# EAGLE design battery_pack (EAGLE 6.6.0)
AUTHOR: Joshua Adkins; REV: A; TITLE: Battery_Pack
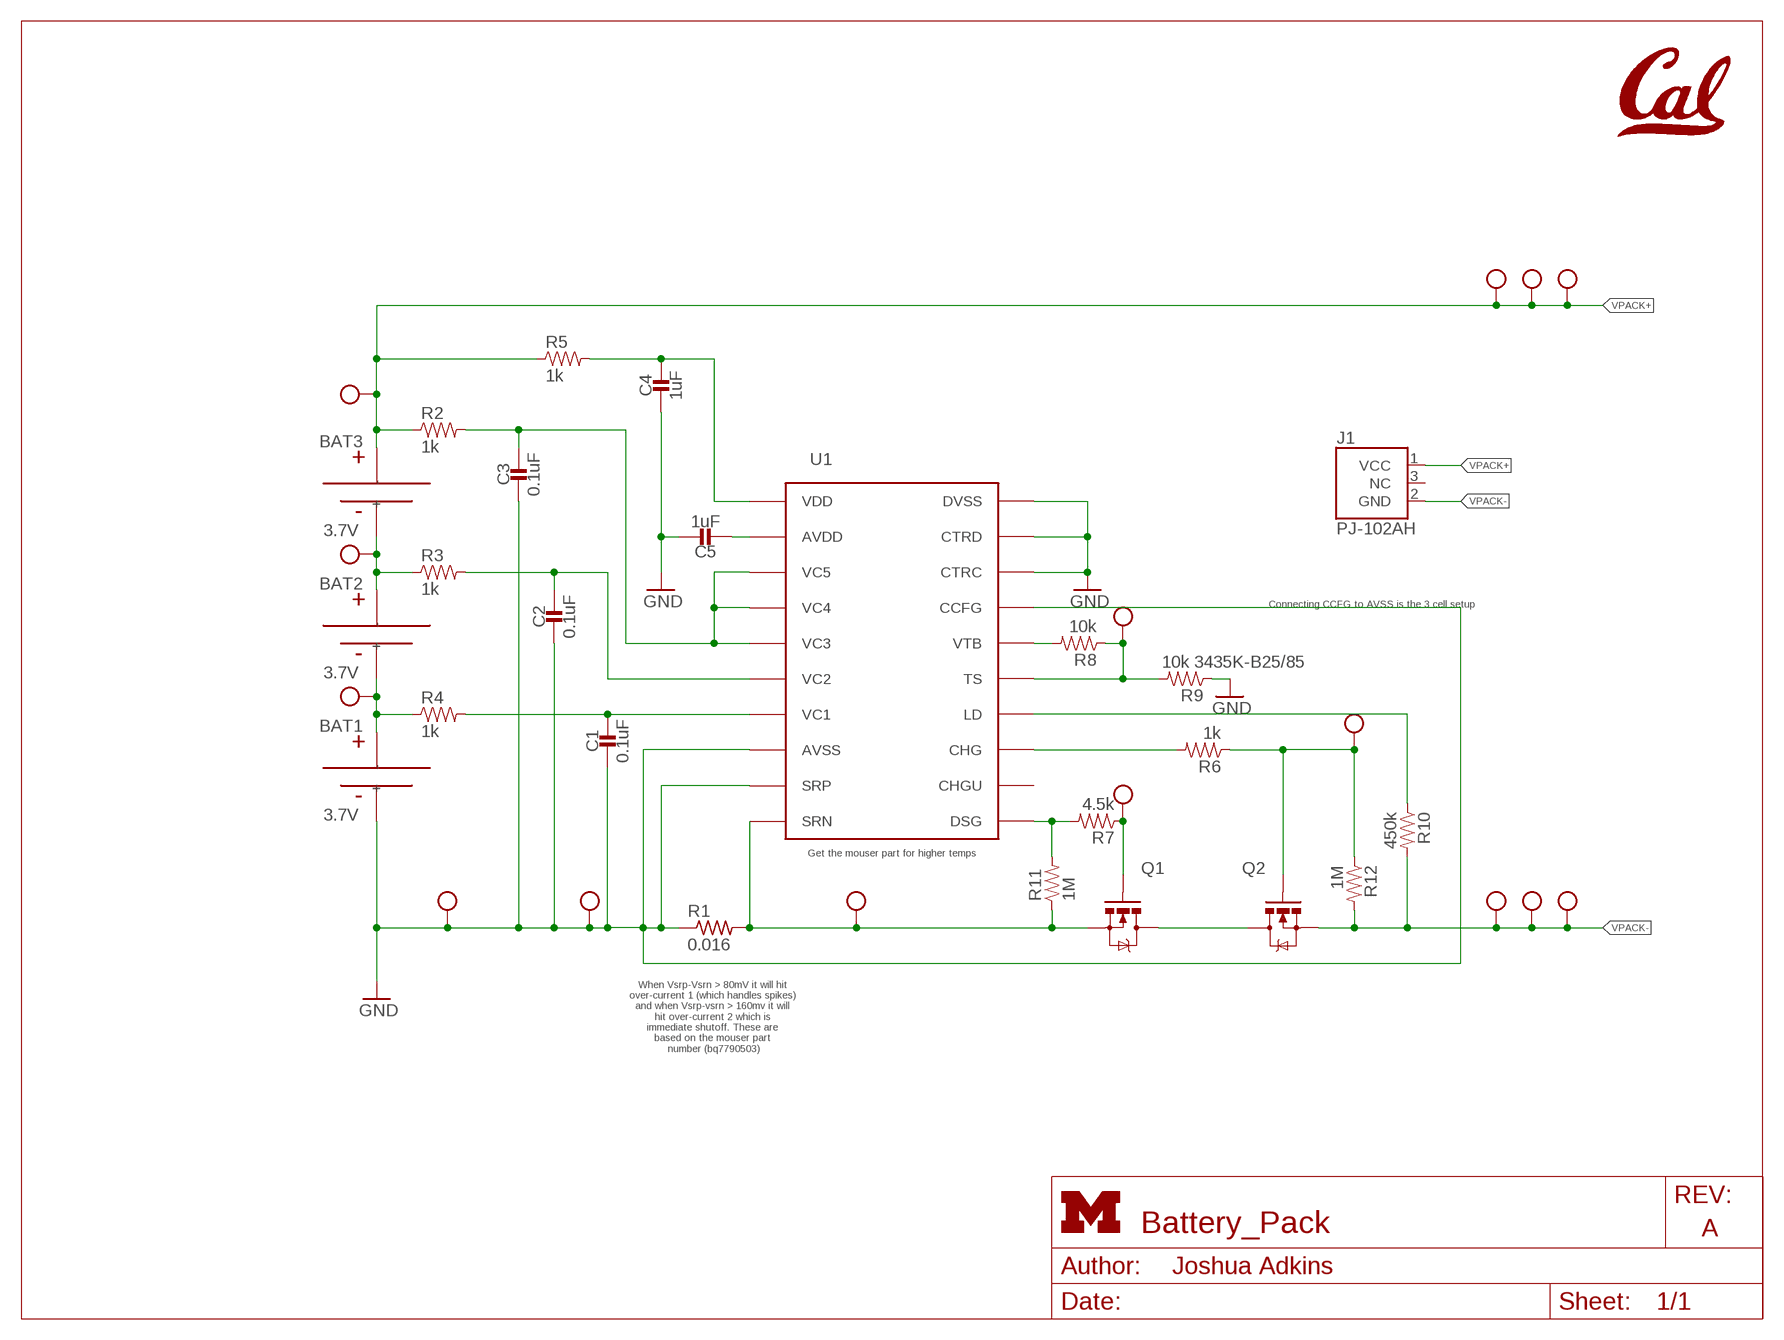
[diagram p0: schematic, sheet 1]
FRAME1 (LETTER_L_UMICH): HEIGHT: 8.5in; WIDTH: 11in

## Parts
BAT1  3.7V  BAT-CELL  [PL-809797-1C]
BAT2  3.7V  BAT-CELL  [PL-809797-1C]
BAT3  3.7V  BAT-CELL  [PL-809797-1C]
C1  0.1uF  CAPACITOR0603_CAP  [0603_CAP]
C2  0.1uF  CAPACITOR0603_CAP  [0603_CAP]
C3  0.1uF  CAPACITOR0603_CAP  [0603_CAP]
C4  1uF  CAPACITOR0603_CAP  [0603_CAP]
C5  1uF  CAPACITOR0603_CAP  [0603_CAP]
J1  PJ-102AH  [PJ-102AH]
Q1  MOSFET-NCHANNELFDD8580  [DPAK]
Q2  MOSFET-NCHANNELFDD8580  [DPAK]
R1  0.016  R-US_R1206  [R1206]
R2  1k  RESISTOR0603_RES  [0603-RES]
R3  1k  RESISTOR0603_RES  [0603-RES]
R4  1k  RESISTOR0603_RES  [0603-RES]
R5  1k  RESISTOR0603_RES  [0603-RES]
R6  1k  RESISTOR0603_RES  [0603-RES]
R7  4.5k  RESISTOR0603_RES  [0603-RES]
R8  10k  RESISTOR0603_RES  [0603-RES]
R9  10k 3435K-B25/85  RESISTOR0603_RES  [0603-RES]
R10  450k  RESISTOR0603_RES  [0603-RES]
R11  1M  RESISTOR0603_RES  [0603-RES]
R12  1M  RESISTOR0603_RES  [0603-RES]
TP1  TEST_POINT_0.112IN  [TESTPOINT_0.112IN]
TP2  TEST_POINT_0.112IN  [TESTPOINT_0.112IN]
TP3  TEST_POINT_0.040IN  [TESTPOINT_0.040IN]
TP4  TEST_POINT_0.040IN  [TESTPOINT_0.040IN]
TP5  TEST_POINT_0.112IN  [TESTPOINT_0.112IN]
TP6  TEST_POINT_0.112IN  [TESTPOINT_0.112IN]
TP7  TEST_POINT_0.112IN  [TESTPOINT_0.112IN]
TP8  TEST_POINT_0.112IN  [TESTPOINT_0.112IN]
TP9  TEST_POINT_0.040IN  [TESTPOINT_0.040IN]
TP10  TEST_POINT_0.040IN  [TESTPOINT_0.040IN]
TP11  TEST_POINT_0.040IN  [TESTPOINT_0.040IN]
TP12  TEST_POINT_0.040IN  [TESTPOINT_0.040IN]
TP13  TEST_POINT_0.040IN  [TESTPOINT_0.040IN]
TP14  TEST_POINT_0.112IN  [TESTPOINT_0.112IN]
TP15  TEST_POINT_0.112IN  [TESTPOINT_0.112IN]
U1  BQ77904  [TSSOP-20/6MM]
U$1  UCB_CAL500MIL  [UCB_CAL_500MIL]

## Nets
GND: BAT1.- C1.2 C2.2 C3.2 C4.2 C5.1 R1.1 R9.1 TP7.1(TESTPOINT) TP9.TESTPOINT U1.8(AVSS) U1.9(SRP) U1.17(CCFG) U1.18(CTRC) U1.19(CTRD) U1.20(DVSS)
N$1: BAT1.+ BAT2.- R4.1 TP15.1(TESTPOINT)
N$2: BAT2.+ BAT3.- R3.1 TP14.1(TESTPOINT)
N$4: C1.1 R4.2 U1.7(VC1)
N$5: C2.1 R3.2 U1.6(VC2)
N$6: C3.1 R2.2 U1.3(VC5) U1.4(VC4) U1.5(VC3)
N$7: Q1.4(D) Q2.4(D)
N$8: Q1.3(S) R1.2 R11.1 TP10.TESTPOINT U1.10(SRN)
N$9: C4.1 R5.2 U1.1(VDD)
N$10: R7.2 R11.2 U1.11(DSG)
N$11: C5.2 U1.2(AVDD)
N$12: Q1.1(G) R7.1 TP11.TESTPOINT
N$13: R6.2 U1.13(CHG)
N$14: Q2.1(G) R6.1 R12.1 TP12.TESTPOINT
N$17: R10.1 U1.14(LD)
N$18: R8.2 U1.16(VTB)
N$19: R8.1 R9.2 TP13.TESTPOINT U1.15(TS)
VPACK+: BAT3.+ J1.1(VCC) R2.1 R5.1 TP1.1(TESTPOINT) TP3.TESTPOINT TP6.1(TESTPOINT) TP8.1(TESTPOINT)
VPACK-: J1.2(GND) Q2.3(S) R10.2 R12.2 TP2.1(TESTPOINT) TP4.TESTPOINT TP5.1(TESTPOINT)
Unconnected: J1.3(NC) U1.12(CHGU)

## Notes on the sheet
- Connecting CCFG to AVSS is the 3 cell setup
- Get the mouser part for higher temps
- When Vsrp-Vsrn > 80mV it will hit 
  over-current 1 (which handles spikes) 
  and when Vsrp-vsrn > 160mv it will 
  hit over-current 2 which is 
  immediate shutoff. These are 
  based on the mouser part 
  number (bq7790503)

## Library data of the parts
BAT1-BAT3 = batteries:BAT-CELL: A single cell of a battery
C1-C5 = passives:CAPACITOR: 0402 Capacitor
J1 = connector:PJ-102AH: DC Power Jack 2.0mm / 5.5mm; DIGIKEY: CP-102AH-ND
Q1 Q2 = fets:MOSFET-NCHANNEL: Generic NMOS footprint
R1 = resistor:R-US_: RESISTOR, American symbol
R2-R12 = passives:RESISTOR: Resistor Basic schematic elements and footprints for 0603, 1206, and PTH resistors.
TP1 TP2 TP5-TP8 TP14 TP15 = headers:TEST_POINT_0.112IN: Solder terminal, turreted; NEWARK: 40F6015
TP3 TP4 TP9-TP13 = headers:TEST_POINT_0.040IN: 0.040in Test Point; DIGIKEY: 5001K-ND
U1 = chips:BQ77904: A battery protection chip with OV/UV/OT/UT; DIGIKEY: 296-44599-5-ND; MOUSER: 595-BQ7790503PW
U$1 = logos:UCB_CAL

## Board
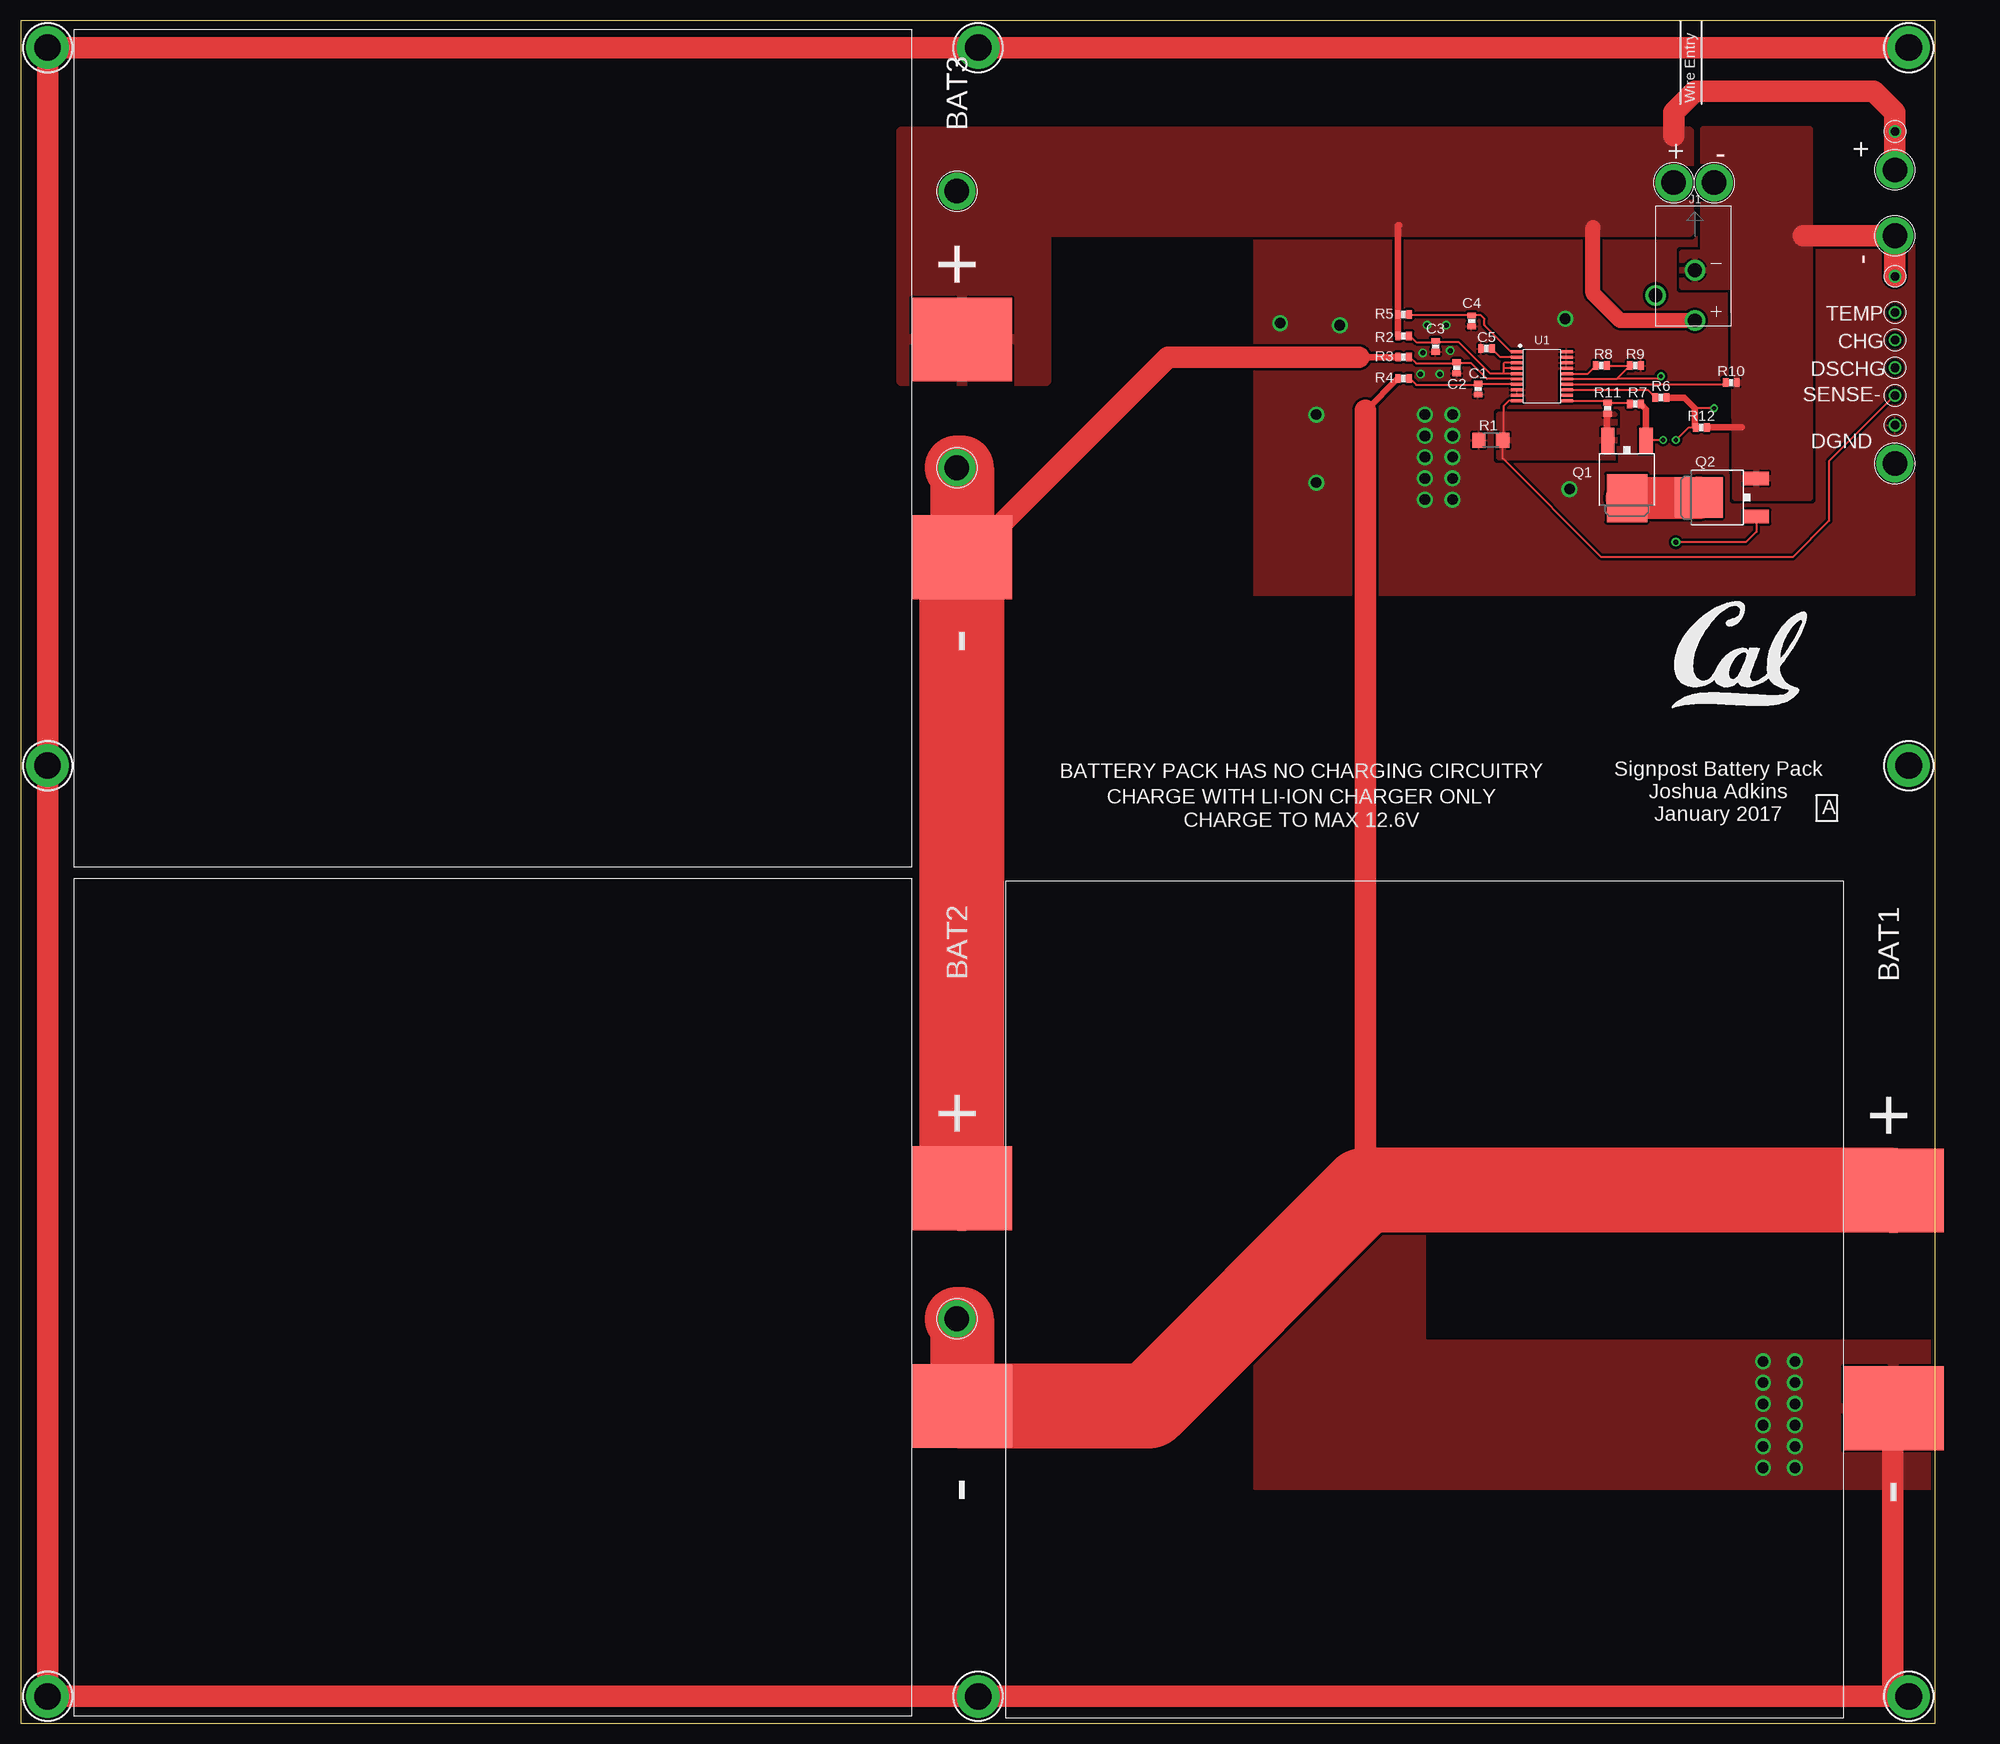
[diagram p1: board, top side]
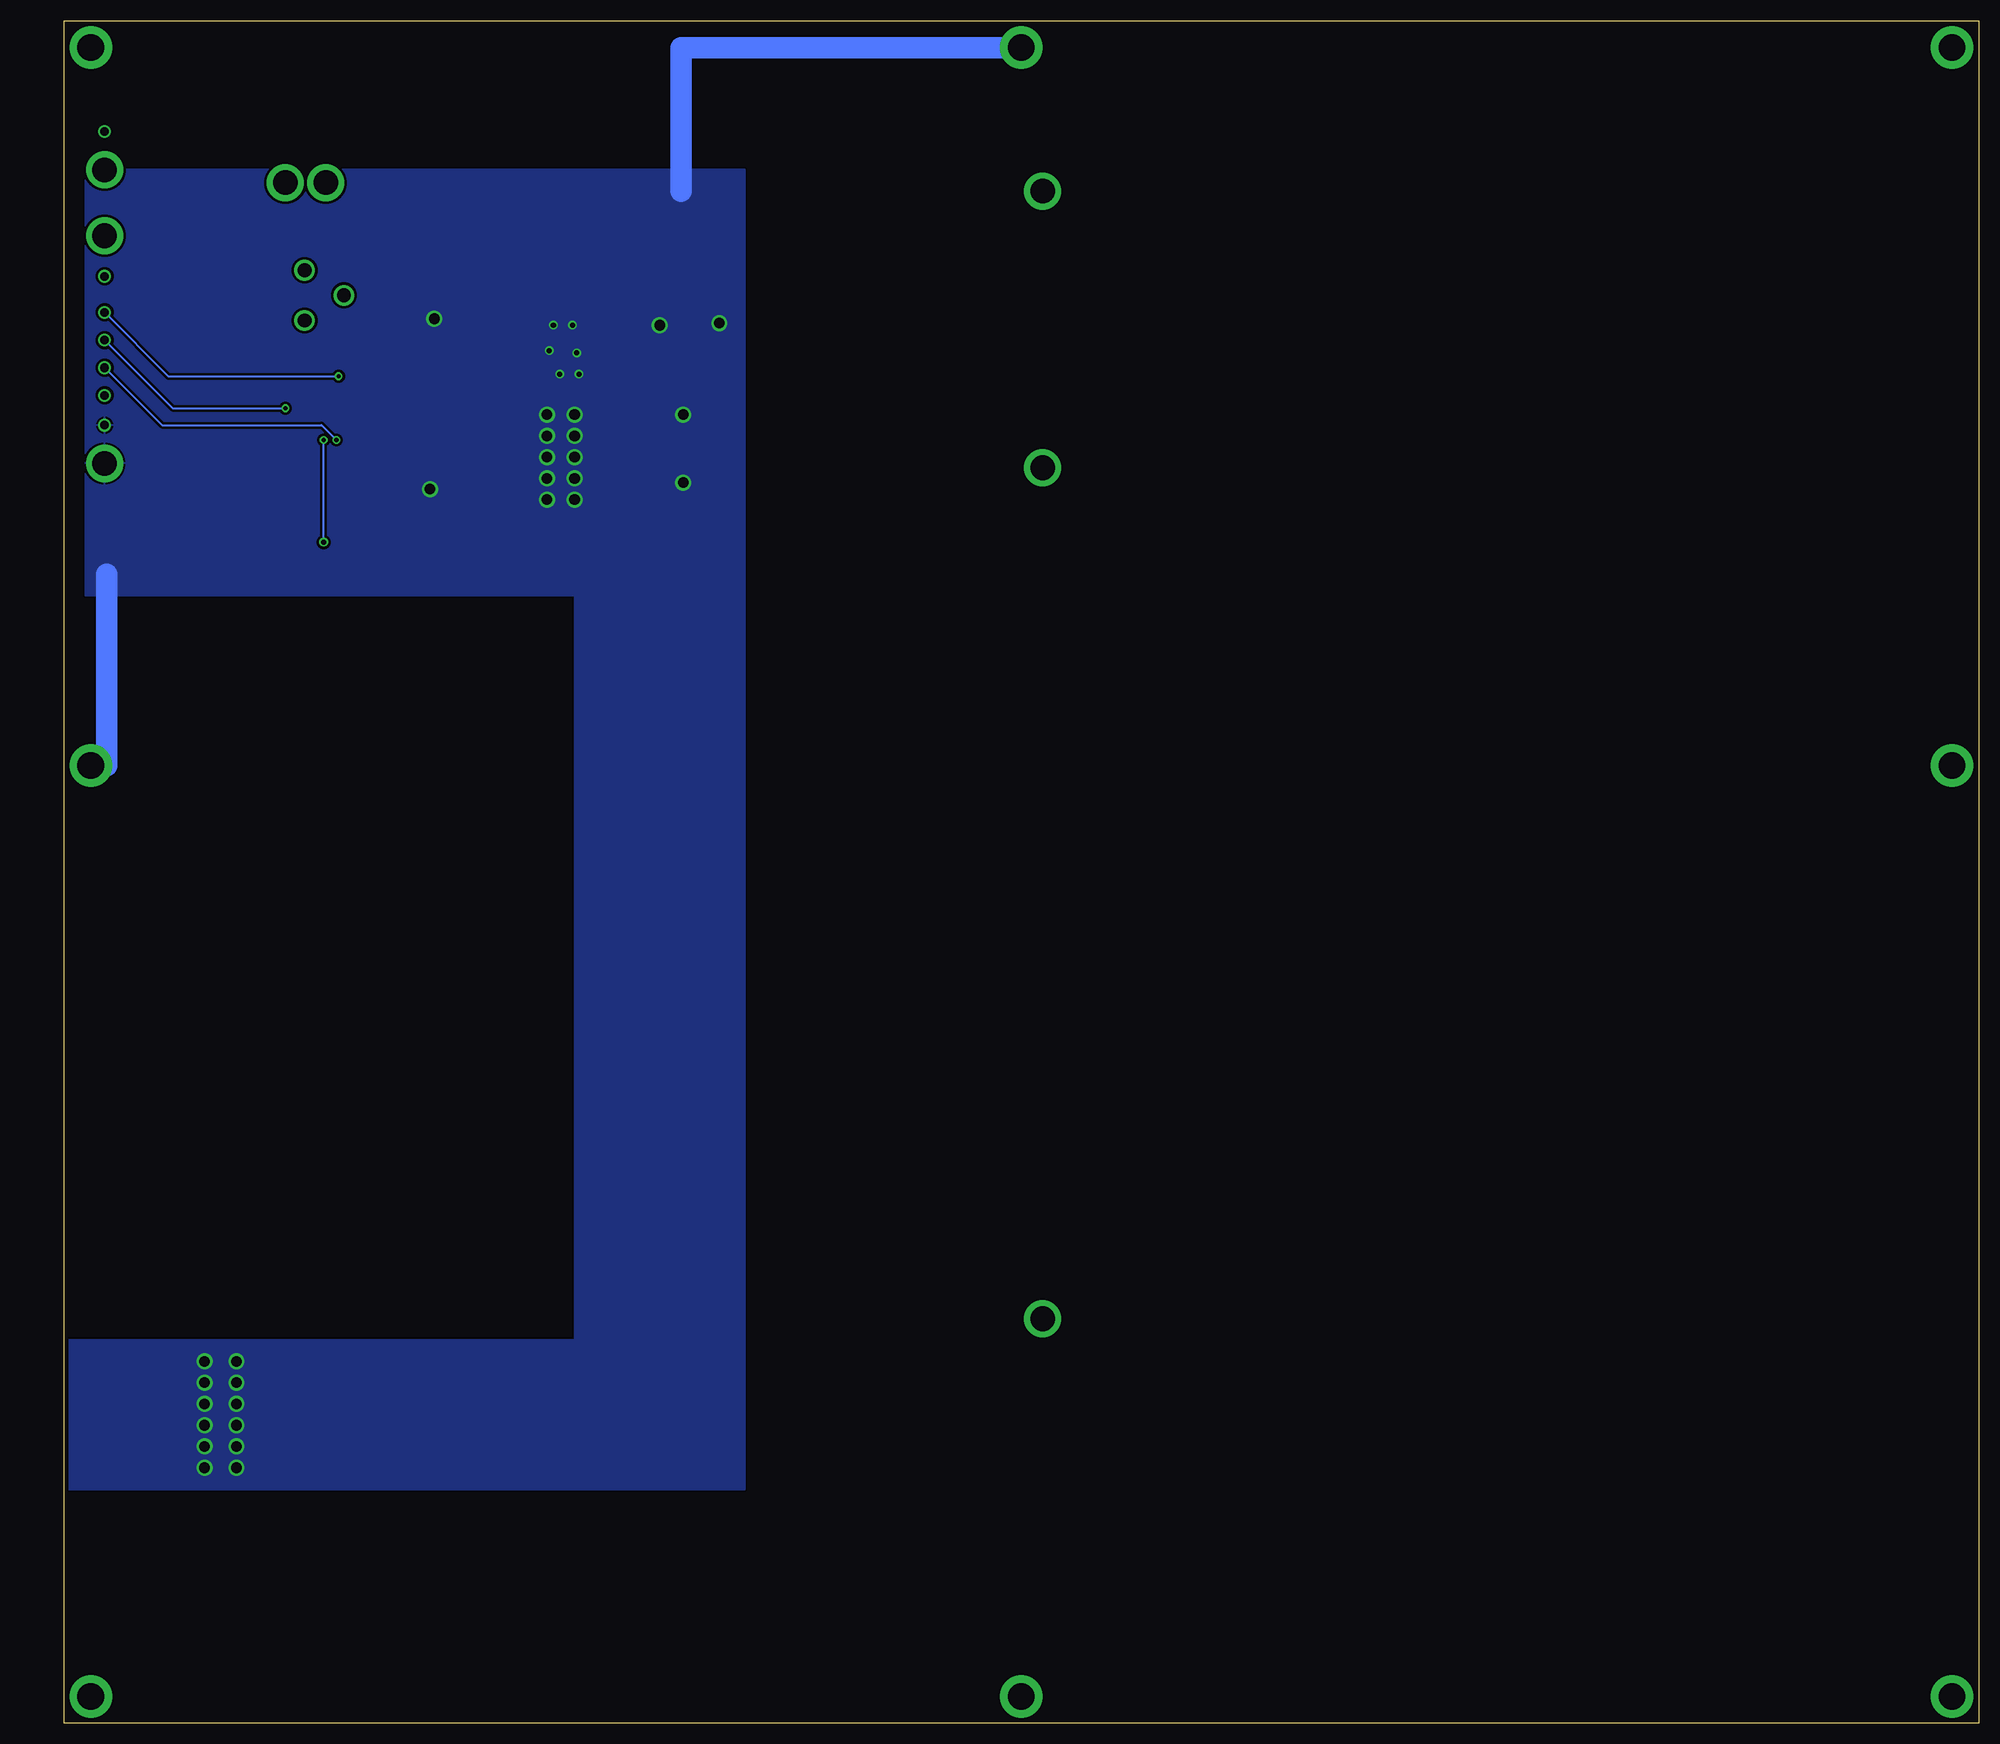
[diagram p2: board, bottom side, seen from below]

Size 228.6 x 203.2 mm. Coordinates in mm from the lower left corner, seen from the top.
Outline: 0,0 228.58,0 228.6,203.2 0,203.2 0,0
Copper layers (1*16): Top 0.0178mm / dielectric 59mil / Bottom 0.0178mm
Design rules "quickturn_co_kr_1oz": minimum track width 4mil, minimum drill 0.200659375mm, track to track 4mil, track to pad 4mil, pad to pad 4mil, via to via 4mil, smd to smd 4mil, copper to edge 20mil, drill to drill 16mil, minimum pad ring 8mil, minimum via ring 8mil, stop-mask expansion 3mil, vias tented up to drill 50mil, thermal gap 10mil

### Footprints (pad centres in the part's own frame; a part is rotated, then mirrored left to right if it is on the bottom)
PL-809797-1C = smd 10 x 12: + 37,106; - 63,106
0603_CAP = smd 0.7 x 1: 1 -0.65,0; 2 0.65,0
PJ-102AH = drill 1.65: 1 0,-3; 2 0,3; 3 -4.7,0
DPAK = smd 1.6 x 3: 1 -2.28,-5.31; 3 2.28,-5.31 | smd 4.826 x 5.715: 4 0,1.588
R1206 = smd 1.6 x 1.803: 1 -1.422,0; 2 1.422,0
0603-RES = smd 0.7 x 1: 1 -0.65,0; 2 0.65,0
TESTPOINT_0.112IN = drill 2.946: 1 0,0
TESTPOINT_0.040IN = drill 1.016: TESTPOINT 0,0
TSSOP-20/6MM = smd 1.5 x 0.35: 1 -2.95,2.925; 2 -2.95,2.275; 3 -2.95,1.625; 4 -2.95,0.975; 5 -2.95,0.325; 6 -2.95,-0.325; 7 -2.95,-0.975; 8 -2.95,-1.625; 9 -2.95,-2.275; 10 -2.95,-2.925; 11 2.95,-2.925; 12 2.95,-2.275; 13 2.95,-1.625; 14 2.95,-0.975; 15 2.95,-0.325; 16 2.95,0.325; 17 2.95,0.975; 18 2.95,1.625; 19 2.95,2.275; 20 2.95,2.925

### Placement (x,y rotation side)
BAT1  117.6,100.58 270 top
BAT2  6.35,100.84 270 top
BAT3  6.35,202.18 270 top
C1  173.99,159.26 270 top
C2  171.45,161.8 270 top
C3  168.91,164.34 270 top
C4  173.23,167.39 270 top
C5  175.01,164.08 0 top
J1  199.9,170.43 0 top
Q1  191.77,147.83 180 top
Q2  201.93,146.3 90 top
R1  175.51,153.16 0 top
R2  165.1,165.61 0 top
R3  165.1,163.07 0 top
R4  165.1,160.53 0 top
R5  165.1,168.15 0 top
R6  195.83,158.24 180 top
R7  192.79,157.48 180 top
R8  188.72,162.05 180 top
R9  192.79,162.05 180 top
R10  204.22,160.02 0 top
R11  189.48,156.97 90 top
R12  200.66,154.69 0 top
TP1  197.36,183.9 0 top
TP2  223.77,177.55 0 top
TP3  223.77,189.99 0 top
TP4  223.77,172.72 0 top
TP5  202.18,183.9 0 top
TP6  223.77,185.42 0 top
TP7  223.77,150.37 0 top
TP8  111.76,182.88 0 top
TP9  223.77,154.94 0 top
TP10  223.77,158.5 90 top
TP11  223.77,161.8 90 top
TP12  223.77,165.1 90 top
TP13  223.77,168.4 90 top
TP14  111.76,149.86 0 top
TP15  111.76,48.26 0 top
U1  181.61,160.78 0 top
U$1  197.1,121.16 0 top

### Tracks (layer width: path | path; a pad name or v marks a point on that pad's centre or on a via)
GND  (via drill 0.61, 1.27, 3.17 pad 5.08)
  Top 2.54: 223.52,38.1 223.52,3.17 v225.43,3.17 v114.3,3.17 v3.17,3.17 v3.17,114.3 | v3.17,114.3 v3.17,200.03 v114.3,200.03 v225.43,200.03 | v3.17,114.3 2.54,114.3
  Bottom 2.54: v114.3,200.03 154.94,200.03 154.94,182.88 | v225.43,114.3 223.52,114.3 223.52,137.16
  other vias: 167.89,166.88 170.18,166.88 167.39,163.58 167.13,161.04 169.42,161.04 170.69,163.83 157.48,166.88 167.64,153.67 167.64,146.05 184.91,147.32 184.4,167.64 150.37,167.13 154.69,156.21 154.69,148.08 211.84,43.18 211.84,40.64 211.84,38.1 211.84,35.56 211.84,33.02 211.84,30.48 208.03,43.18 208.03,40.64 208.03,38.1 208.03,35.56 208.03,33.02 208.03,30.48 167.64,148.59 167.64,151.13 167.64,156.21 170.94,146.05 170.94,148.59 170.94,151.13 170.94,153.67 170.94,156.21
  pour Bottom (isolate 0.305): 147.32,185.42 226.06,185.42 226.06,134.62 147.32,134.62
  pour Top (isolate 0.305, rank 2): 147.32,185.42 226.06,185.42 226.06,134.62 147.32,134.62
  pour Top (isolate 0.305): 216.41,43.94 216.41,29.97 228.35,29.97 228.35,43.94
  pour Bottom (isolate 0.305): 228.6,27.94 147.32,27.94 147.32,144.78 167.64,144.78 167.64,45.72 228.6,45.72
  pour Top (isolate 0.305): 228.6,27.94 147.32,27.94 147.32,144.78 167.64,144.78 167.64,45.72 228.6,45.72
N$1
  Top 0.254: 160.53,156.72 160.64,156.72
  Top 0.762: 160.64,156.72 R4.1
  Top 10.16: BAT1.+ 160.36,63.58 159.89,63.12 134.62,37.85 BAT2.-
  Top 2.54: 160.53,156.72 160.53,63.75 159.89,63.12
  Top 7.62: TP15.1 112.35,48.26 BAT2.-
N$2
  Top 0.762: R3.1 159.77,163.07
  Top 10.16: BAT2.+ 112.35,137.16 112.35,138.43 BAT3.-
  Top 2.54: 159.77,163.07 136.99,163.07 112.35,138.43
  Top 7.62: TP14.1 112.35,149.86 112.35,137.16
N$4
  Top 0.254: R4.2 165.86,160.53 166.62,159.77 173.85,159.77 C1.1 174.09,159.81 U1.7
N$5
  Top 0.254: U1.6 175.08,160.46 173.23,162.31 171.59,162.31 C2.1 171.31,162.31 166.62,162.31 165.86,163.07 R3.2
N$6
  Top 0.254: U1.5 177.04,161.11 | 177.04,161.11 175.44,161.11 171.7,164.85 169.05,164.85 C3.1 168.77,164.85 166.62,164.85 165.86,165.61 R2.2 | U1.3 177.14,162.41 177.04,162.31 177.04,161.8 | 177.04,161.8 177.04,161.11 | U1.4 177.08,161.76 177.04,161.8
N$7
  Top 5.08: Q1.4 Q2.4
N$8
  Top 0.254: U1.10 177.67,157.86 177.04,157.23 177.04,153.26 R1.2 176.94,150.98 188.72,139.19 211.58,139.19 215.9,143.51 215.9,150.62 TP10.TESTPOINT
  Top 0.762: 189.36,153.26 189.36,156.2 R11.1
  Top 1.27: 189.36,153.26 Q1.3
  pour Top (isolate 0.305): 176.53,151.13 190.25,151.13 190.25,156.21 176.53,156.21
N$9
  Top 0.254: R5.2 173.12,168.15 C4.1 174.36,168.04 174.75,167.64 174.75,166.88 177.92,163.71 U1.1
N$10
  Top 0.254: U1.11 189.25,157.86 R11.2 191.99,157.62 R7.2
N$11
  Top 0.254: U1.2 176.68,163.06 C5.2
N$12  (via drill 0.51)
  Top 0.254: v196.09,153.16 194.07,153.16 Q1.1
  Top 0.762: Q1.1 194.05,156.87 R7.1
  Bottom 0.254: TP11.TESTPOINT 216.92,154.94 197.87,154.94 v196.09,153.16
N$13
  Top 0.254: U1.13 194.27,159.16 R6.2
N$14  (via drill 0.51, 0.61)
  Top 0.254: Q2.1 207.24,142.22 205.99,140.97 v197.61,140.97 | v197.61,153.16 199.14,154.69 R12.1 199.9,154.8 | v202.18,156.97 199.9,156.97
  Top 0.762: R6.1 198.63,158.24 199.9,156.97 199.9,154.8
  Bottom 0.254: v197.61,140.97 v197.61,153.16 | TP12.TESTPOINT 215.65,156.97 v202.18,156.97
N$17
  Top 0.254: U1.14 203.35,159.81 R10.1
N$18
  Top 0.254: U1.16 187.13,161.11 R8.2
N$19  (via drill 0.51)
  Top 0.254: R8.1 R9.2 190.54,160.46 | U1.15 190.54,160.46 | v195.83,160.78 195.51,160.46 190.54,160.46
  Bottom 0.254: TP13.TESTPOINT 216.15,160.78 v195.83,160.78
VPACK+
  Top 0.762: R2.1 R5.1 164.45,178.82 164.59,178.82
  Top 1.778: J1.1 190.96,167.43 187.71,170.69 187.71,178.56
  Top 2.54: TP6.1 TP3.TESTPOINT 223.77,192.28 221.23,194.82 199.9,194.82 197.36,192.28 197.36,189.48
  pour Top (isolate 0.305): 105.16,160.27 105.16,189.99 199.14,189.99 199.14,178.05 122.43,178.05 122.43,160.53 122.43,160.27
VPACK-
  Top 0.762: R12.2 205.49,154.69
  Top 2.54: 212.85,177.55 TP2.1 TP4.TESTPOINT
  pour Top (isolate 0.305): 204.72,146.3 204.47,171.45 198.37,171.45 198.37,175.51 200.91,175.51 200.91,190.25 213.61,190.25 213.61,146.3

### Text on the board
tPlace: Wire Entry | - | + | + | - | TEMP | CHG | DSCHG | SENSE- | DGND | BATTERY PACK HAS NO CHARGING CIRCUITRY | CHARGE WITH LI-ION CHARGER ONLY | Signpost Battery Pack / Joshua Adkins / January 2017 | A | CHARGE TO MAX 12.6V